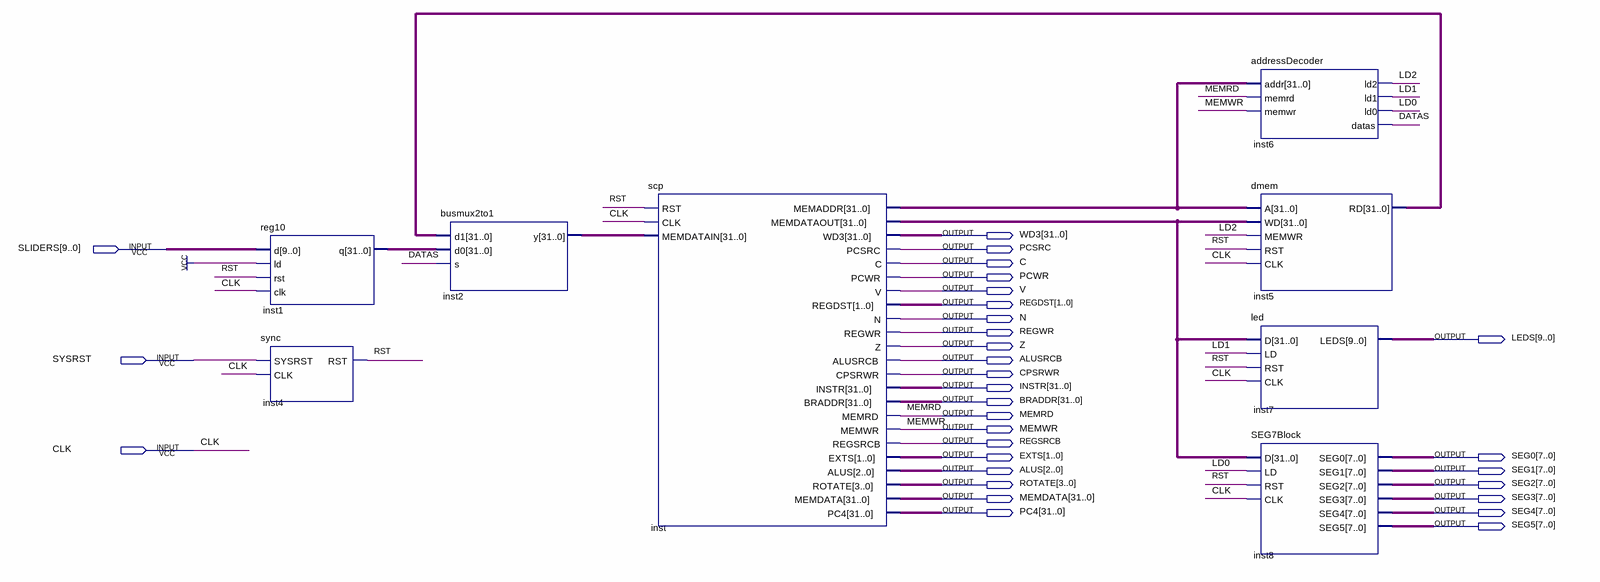
[diagram p0: schematic sheet]
// Quartus schematic system.bdf as structural Verilog: 8 symbols, 31 pins
module system (
  input  [9:0] SLIDERS,
  input  SYSRST,
  input  CLK,
  output [31:0] WD3,
  output PCSRC,
  output C,
  output PCWR,
  output V,
  output [1:0] REGDST,
  output N,
  output REGWR,
  output [9:0] LEDS,
  output Z,
  output ALUSRCB,
  output CPSRWR,
  output [31:0] INSTR,
  output [31:0] BRADDR,
  output MEMRD,
  output MEMWR,
  output REGSRCB,
  output [1:0] EXTS,
  output [7:0] SEG0,
  output [2:0] ALUS,
  output [7:0] SEG1,
  output [3:0] ROTATE,
  output [7:0] SEG2,
  output [31:0] MEMDATA,
  output [7:0] SEG3,
  output [31:0] PC4,
  output [7:0] SEG4,
  output [7:0] SEG5
);

  wire DATAS, LD0, LD1, LD2, RST;
  wire [31:0] inst1_q, inst2_y, inst5_rd, inst_memaddr, inst_memdataout;

  reg10 inst1 (.d(SLIDERS), .ld(1'b1), .rst(RST), .clk(CLK), .q(inst1_q));
  sync inst4 (.SYSRST(SYSRST), .CLK(CLK), .RST(RST));
  busmux2to1 inst2 (.d1(inst5_rd), .d0(inst1_q), .s(DATAS), .y(inst2_y));
  scp inst (
    .RST(RST), .CLK(CLK), .MEMDATAIN(inst2_y), .MEMADDR(inst_memaddr), .MEMDATAOUT(inst_memdataout),
    .WD3(WD3), .PCSRC(PCSRC), .C(C), .PCWR(PCWR), .V(V), .REGDST(REGDST), .N(N), .REGWR(REGWR), .Z(Z),
    .ALUSRCB(ALUSRCB), .CPSRWR(CPSRWR), .INSTR(INSTR), .BRADDR(BRADDR), .MEMRD(MEMRD), .MEMWR(MEMWR),
    .REGSRCB(REGSRCB), .EXTS(EXTS), .ALUS(ALUS), .ROTATE(ROTATE), .MEMDATA(MEMDATA), .PC4(PC4));
  addressDecoder inst6 (
    .addr(inst_memaddr), .memrd(MEMRD), .memwr(MEMWR), .ld2(LD2), .ld1(LD1), .ld0(LD0), .datas(DATAS));
  dmem inst5 (.A(inst_memaddr), .WD(inst_memdataout), .MEMWR(LD2), .RST(RST), .CLK(CLK), .RD(inst5_rd));
  led inst7 (.D(inst_memdataout), .LD(LD1), .RST(RST), .CLK(CLK), .LEDS(LEDS));
  SEG7Block inst8 (
    .D(inst_memdataout), .LD(LD0), .RST(RST), .CLK(CLK), .SEG0(SEG0), .SEG1(SEG1), .SEG2(SEG2), .SEG3(SEG3),
    .SEG4(SEG4), .SEG5(SEG5));
endmodule
